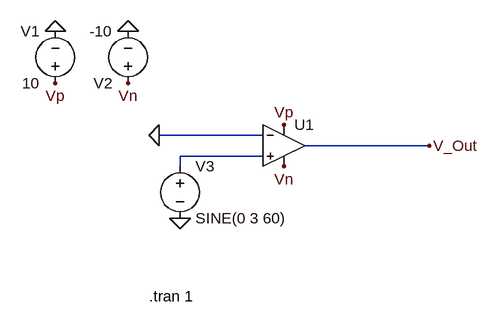
[diagram p0: schematic OP_Amp.asc]
OP_Amp.asc, the LTspice schematic file:
Version 4.1
SHEET 1 880 680
WIRE 112 112 -48 112
WIRE 368 128 176 128
WIRE 112 144 -16 144
WIRE -16 160 -16 144
FLAG -96 -48 0
FLAG -48 112 0
FLAG -16 240 0
FLAG -208 -48 0
FLAG -208 32 Vp
FLAG 144 96 Vp
FLAG -96 32 Vn
FLAG 144 160 Vn
FLAG 368 128 V_Out
SYMBOL OpAmps\\UniversalOpAmp2 144 128 R0
SYMATTR InstName U1
SYMBOL voltage -96 48 R180
WINDOW 123 0 0 Left 0
WINDOW 39 0 0 Left 0
SYMATTR InstName V2
SYMATTR Value -10
SYMBOL voltage -16 144 R0
WINDOW 123 0 0 Left 0
WINDOW 39 0 0 Left 0
SYMATTR InstName V3
SYMATTR Value SINE(0 3 60)
SYMBOL voltage -208 48 R180
WINDOW 0 24 96 Left 2
WINDOW 3 24 16 Left 2
WINDOW 123 0 0 Left 0
WINDOW 39 0 0 Left 0
SYMATTR InstName V1
SYMATTR Value 10
TEXT -64 360 Left 2 !.tran 1

The netlist it stands for:
* OP_Amp.asc
X§U1 N001 0 Vp Vn V_Out level2 Avol=1Meg GBW=10Meg Slew=10Meg Ilimit=25m Rail=0 Vos=0 En=0 Enk=0 In=0 Ink=0 Rin=500Meg  ; pins In+ In- V+ V- OUT
V2 Vn 0 -10
V3 N001 0 SINE(0 3 60)
V1 Vp 0 10
.tran 1
.lib UniversalOpAmp2.lib
.backanno
.end